# EAGLE schematic bot (EAGLE 9.3.1)
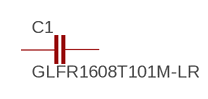
[diagram p0: schematic, sheet 1]

## Parts
C1  GLFR1608T101M-LR  [CAPC1608X95]
Unconnected: C1.1 C1.2

## Library data of the parts
C1 = GLFR1608T101M-LR:GLFR1608T101M-LR: FIXED IND 100UH 80MA 5.5 OHM SMD; DESCRIPTION: Inductor Power Chip Shielded Wirewound 100uH 20% 80mA 5.5Ohm DCR 0603 T/R; DIGI-KEY_PART_NUMBER: 445-6150-1-ND; DIGI-KEY_PURCHASE_URL: https://www.digikey.com/product-detail/en/tdk-corporation/GLFR1608T101M-LR/445-6150-1-ND/2465476?utm_source=snapeda&utm_medium=aggregator&utm_campaign=symbol; MF: TDK; MP: GLFR1608T101M-LR; PACKAGE: 0603 TDK